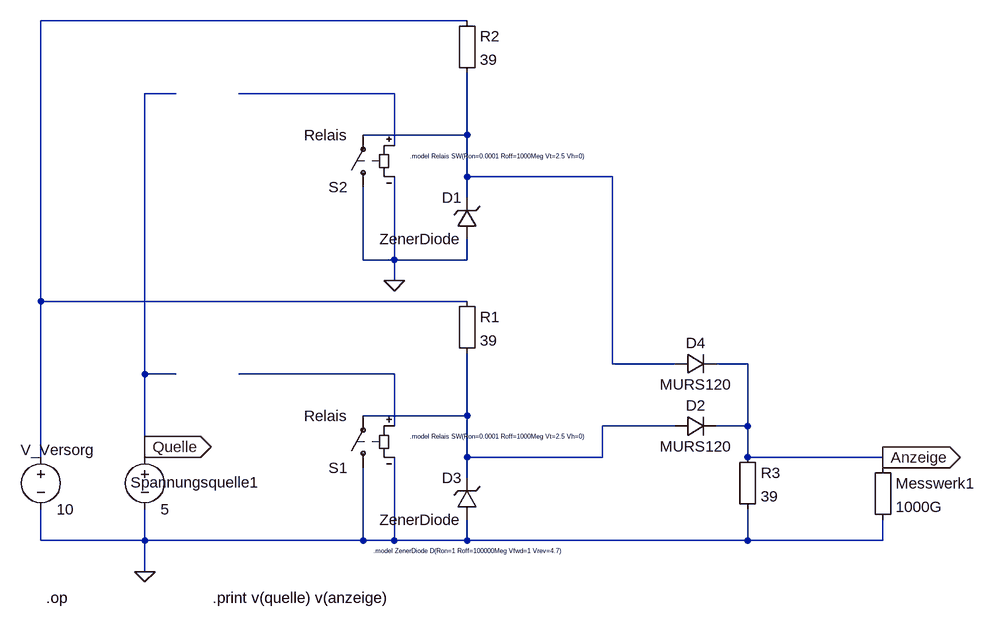
[diagram p0: schematic V2 NAND2.asc]
V2 NAND2.asc, the LTspice schematic file:
Version 4
SHEET 1 920 680
WIRE -144 -496 -800 -496
WIRE -592 -384 -640 -384
WIRE -256 -384 -496 -384
WIRE -144 -320 -144 -416
WIRE -144 -320 -304 -320
WIRE -256 -304 -256 -384
WIRE -144 -256 -144 -320
WIRE 80 -256 -144 -256
WIRE -144 -224 -144 -256
WIRE -304 -128 -304 -240
WIRE -256 -128 -256 -256
WIRE -256 -128 -304 -128
WIRE -144 -128 -144 -160
WIRE -144 -128 -256 -128
WIRE -256 -96 -256 -128
WIRE -800 -64 -800 -496
WIRE -144 -64 -800 -64
WIRE 80 32 80 -256
WIRE 176 32 80 32
WIRE 288 32 240 32
WIRE -640 48 -640 -384
WIRE -592 48 -640 48
WIRE -256 48 -496 48
WIRE -144 112 -144 16
WIRE -144 112 -304 112
WIRE -256 128 -256 48
WIRE 176 128 64 128
WIRE 288 128 288 32
WIRE 288 128 240 128
WIRE -640 160 -640 48
WIRE -800 176 -800 -64
WIRE -640 176 -640 160
WIRE -144 176 -144 112
WIRE 64 176 64 128
WIRE 64 176 -144 176
WIRE 288 176 288 128
WIRE 496 176 288 176
WIRE 496 192 496 176
WIRE -144 208 -144 176
WIRE -800 304 -800 256
WIRE -640 304 -640 256
WIRE -640 304 -800 304
WIRE -304 304 -304 192
WIRE -304 304 -640 304
WIRE -256 304 -256 176
WIRE -256 304 -304 304
WIRE -144 304 -144 272
WIRE -144 304 -256 304
WIRE 288 304 288 256
WIRE 288 304 -144 304
WIRE 496 304 496 272
WIRE 496 304 288 304
WIRE -640 352 -640 304
FLAG -640 160 Quelle
IOPIN -640 160 Out
FLAG -640 352 0
FLAG -256 -96 0
FLAG 496 176 Anzeige
IOPIN 496 176 Out
SYMBOL Misc\\EuropeanResistor -160 -80 R0
SYMATTR InstName R1
SYMATTR Value 39
SYMBOL zener -128 272 R180
WINDOW 0 24 64 Left 2
WINDOW 3 24 0 Left 2
SYMATTR InstName D3
SYMATTR Value ZenerDiode
SYMATTR Description Diode
SYMATTR Type diode
SYMBOL voltage -800 160 R0
WINDOW 0 -31 5 Left 2
SYMATTR InstName V_Versorg
SYMATTR Value 10
SYMBOL sw -304 208 R180
SYMATTR InstName S1
SYMATTR Value Relais
SYMBOL voltage -640 160 R0
WINDOW 0 -22 55 Left 2
WINDOW 123 0 0 Left 0
WINDOW 39 0 0 Left 0
SYMATTR InstName Spannungsquelle1
SYMATTR Value 5
SYMBOL Misc\\EuropeanResistor -160 -512 R0
SYMATTR InstName R2
SYMATTR Value 39
SYMBOL zener -128 -160 R180
WINDOW 0 24 64 Left 2
WINDOW 3 24 0 Left 2
SYMATTR InstName D1
SYMATTR Value ZenerDiode
SYMATTR Description Diode
SYMATTR Type diode
SYMBOL sw -304 -224 R180
SYMATTR InstName S2
SYMATTR Value Relais
SYMBOL Misc\\EuropeanResistor 480 176 R0
SYMATTR InstName Messwerk1
SYMATTR Value 1000G
SYMBOL Misc\\EuropeanResistor 272 160 R0
SYMATTR InstName R3
SYMATTR Value 39
SYMBOL diode 176 144 R270
WINDOW 0 32 32 VTop 2
WINDOW 3 0 32 VBottom 2
SYMATTR InstName D2
SYMATTR Value MURS120
SYMBOL diode 176 48 R270
WINDOW 0 32 32 VTop 2
WINDOW 3 0 32 VBottom 2
SYMATTR InstName D4
SYMATTR Value MURS120
TEXT -792 392 Left 2 !.op
TEXT -536 392 Left 2 !.print v(quelle) v(anzeige)
TEXT -288 320 Left 0 !.model ZenerDiode D(Ron=1 Roff=100000Meg Vfwd=1 Vrev=4.7)
TEXT -232 144 Left 0 !.model Relais SW(Ron=0.0001 Roff=1000Meg Vt=2.5 Vh=0)
TEXT -232 -288 Left 0 !.model Relais SW(Ron=0.0001 Roff=1000Meg Vt=2.5 Vh=0)

The netlist it stands for:
* V2 NAND2.asc
R1 N001 N005 39
D3 0 N005 ZenerDiode
V_Versorg N001 0 10
S1 0 N005 N004 0 Relais
V§Spannungsquelle1 Quelle 0 5
R2 N001 N003 39
D1 0 N003 ZenerDiode
S2 0 N003 N002 0 Relais
R§Messwerk1 Anzeige 0 1000G
R3 Anzeige 0 39
D2 N005 Anzeige MURS120
D4 N003 Anzeige MURS120
.model D D
.lib standard.dio
.op
.print v(quelle) v(anzeige)
.model ZenerDiode D(Ron=1 Roff=100000Meg Vfwd=1 Vrev=4.7)
.model Relais SW(Ron=0.0001 Roff=1000Meg Vt=2.5 Vh=0)
.model Relais SW(Ron=0.0001 Roff=1000Meg Vt=2.5 Vh=0)
.backanno
.end